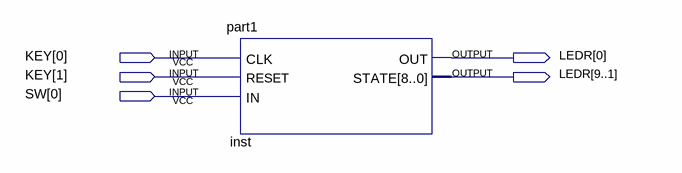
[diagram p0: schematic sheet]
// Quartus schematic Block1.bdf as structural Verilog: 1 symbols, 5 pins
module Block1 (
  input  [1:0] KEY,
  input  [0:0] SW,
  output [9:0] LEDR
);

  part1 inst (.CLK(KEY[0]), .RESET(KEY[1]), .IN(SW[0]), .OUT(LEDR[0]), .STATE(LEDR[9:1]));
endmodule
